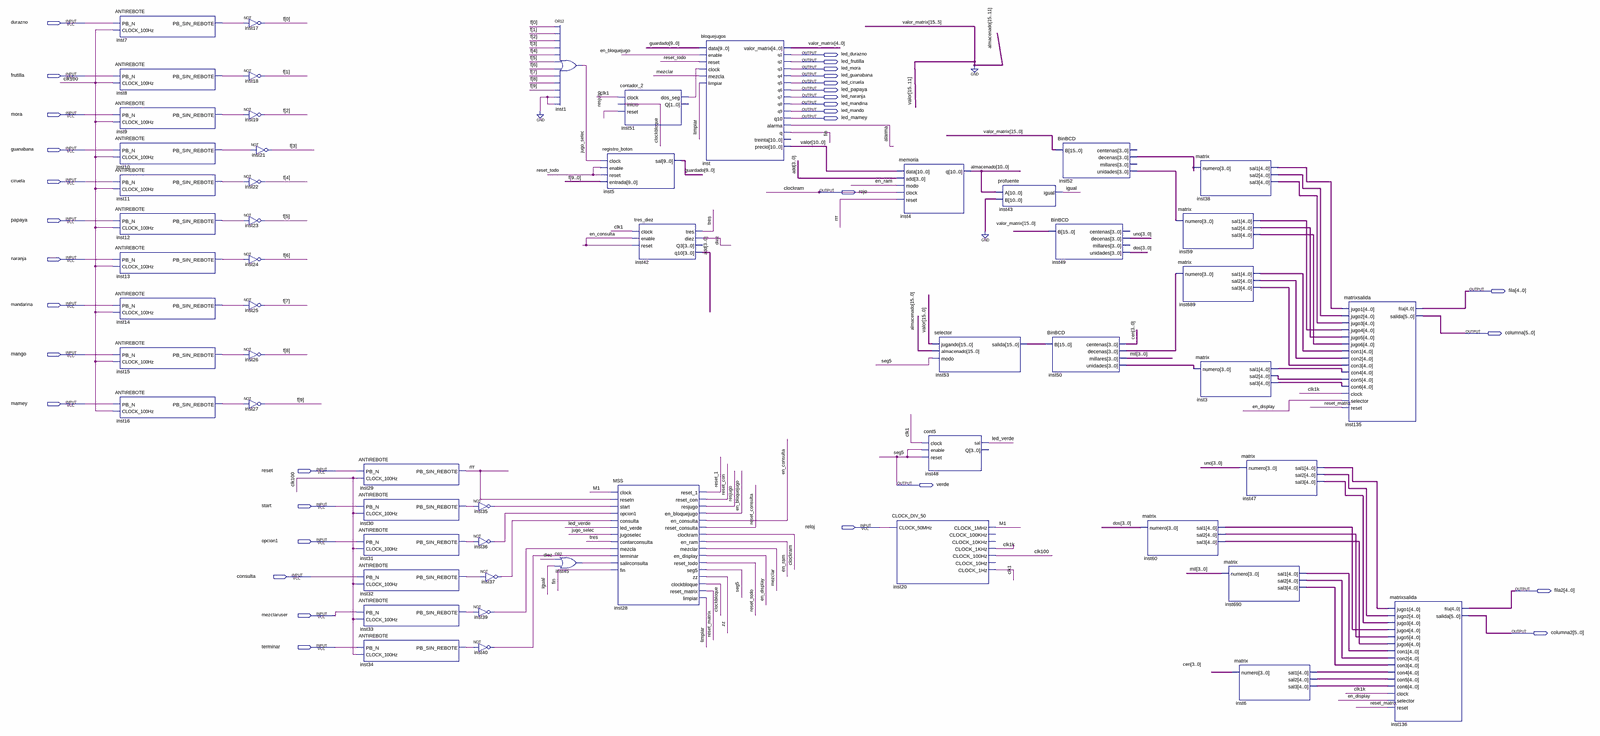
[diagram p0: schematic sheet, whole]
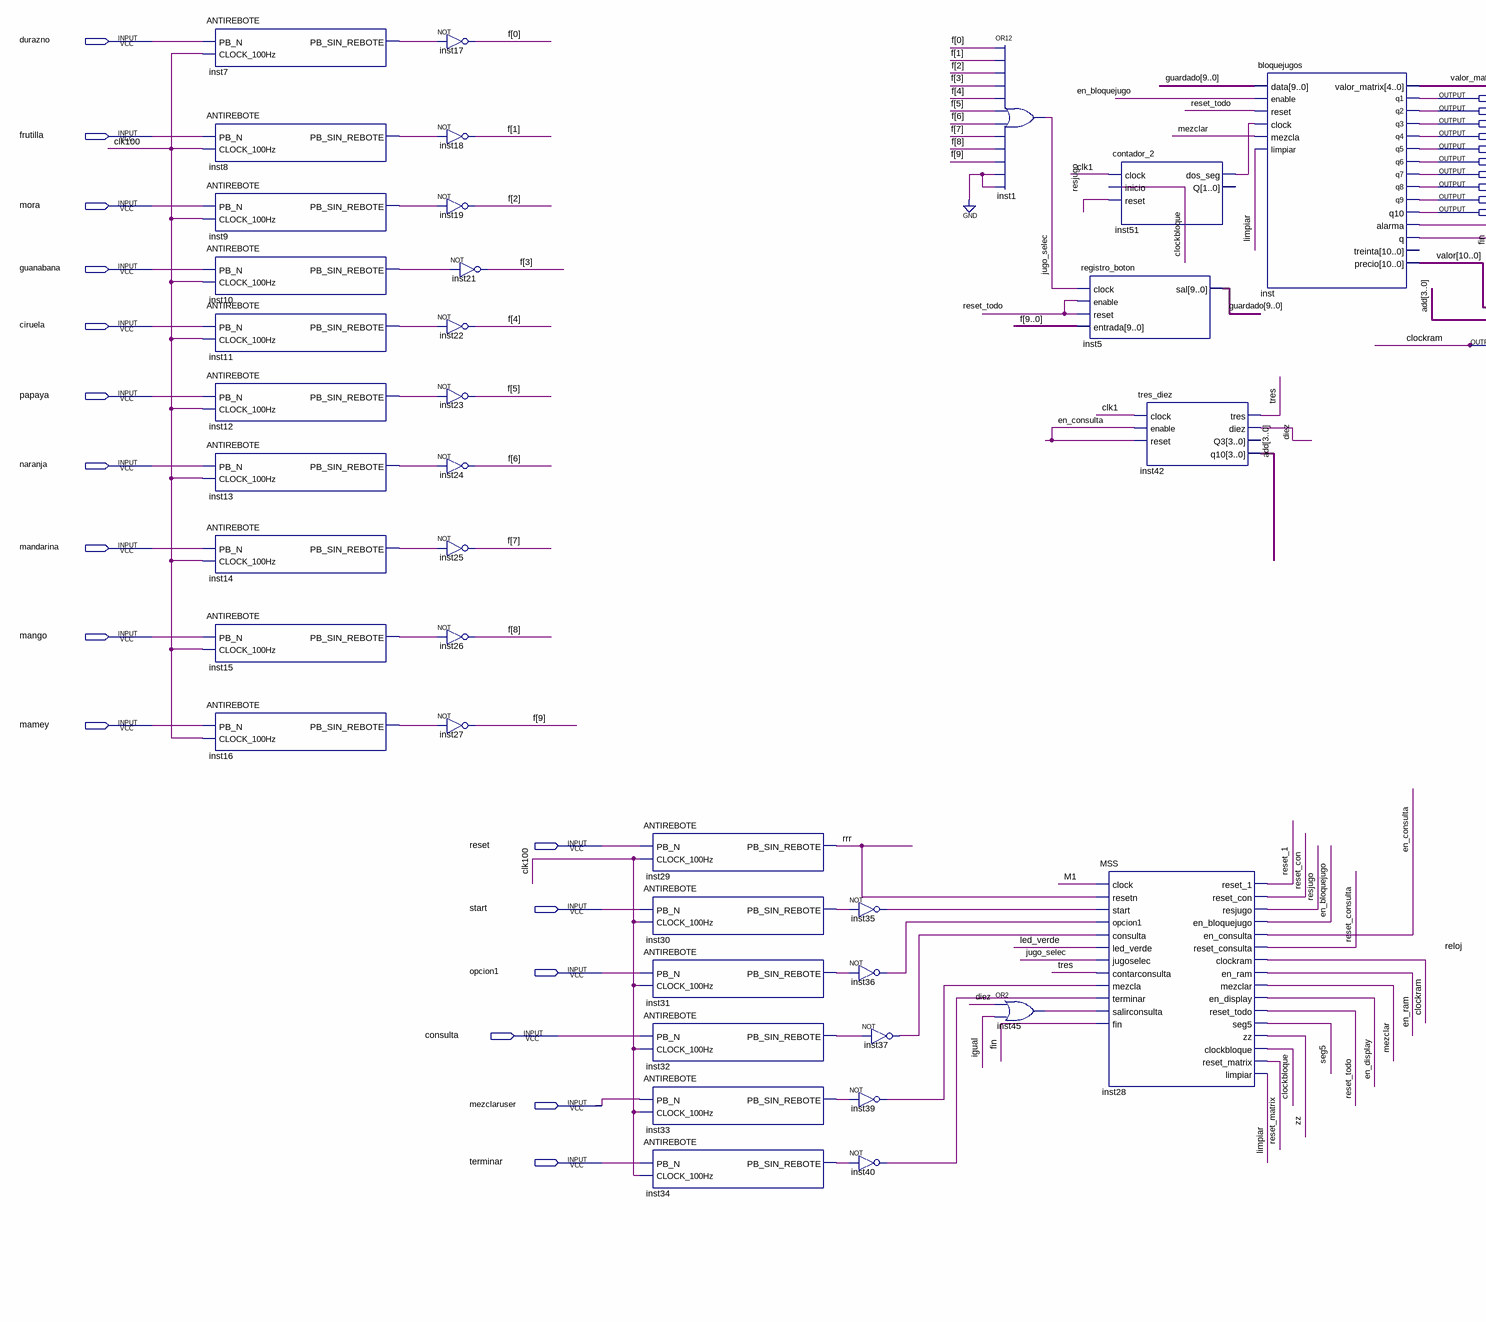
[diagram p1: schematic sheet, left part]
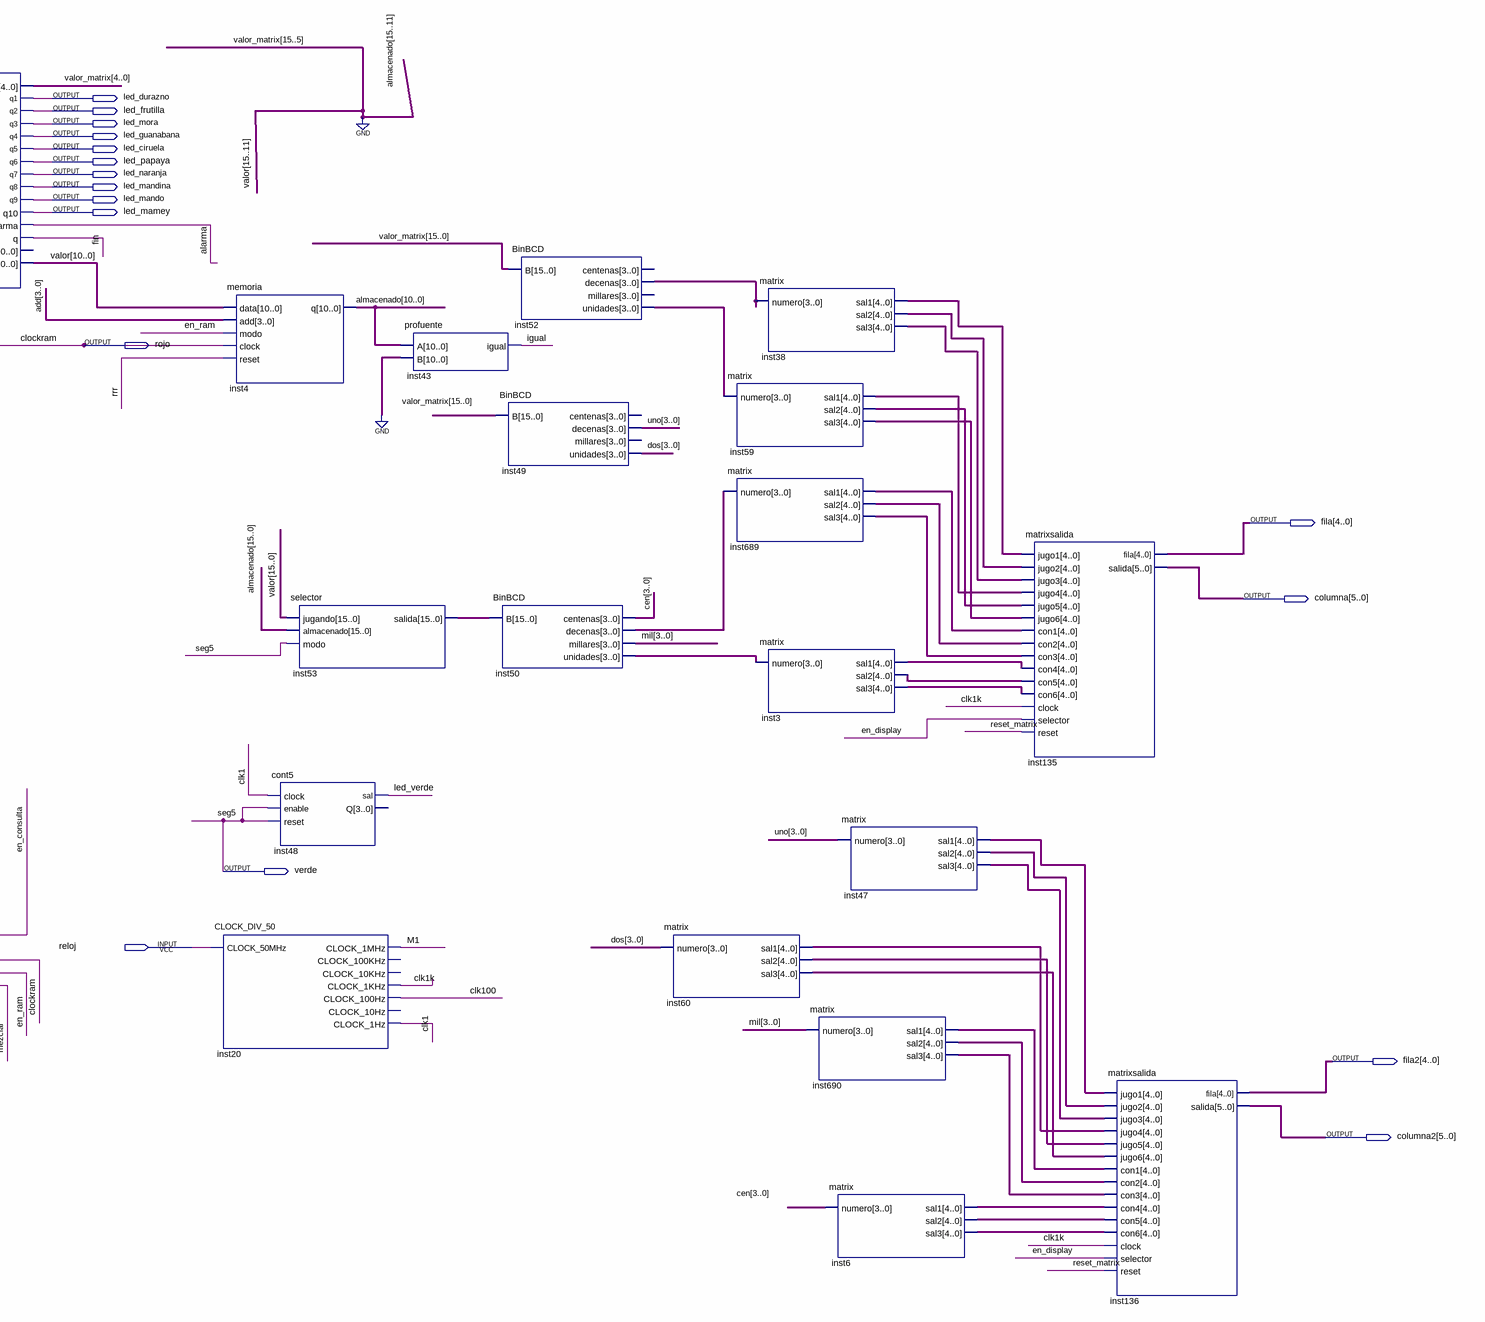
[diagram p2: schematic sheet, right part]
// Quartus schematic jugo.bdf as structural Verilog: 56 symbols, 33 pins
module jugo (
  input  durazno,
  input  frutilla,
  input  mora,
  input  guanabana,
  input  ciruela,
  input  papaya,
  input  naranja,
  input  mandarina,
  input  mango,
  input  mamey,
  input  reset,
  input  start,
  input  reloj,
  input  opcion1,
  input  consulta,
  input  mezclaruser,
  input  terminar,
  output led_durazno,
  output led_frutilla,
  output led_mora,
  output led_guanabana,
  output led_ciruela,
  output led_papaya,
  output led_naranja,
  output led_mandina,
  output led_mando,
  output led_mamey,
  output rojo,
  output [4:0] fila,
  output [5:0] columna,
  output verde,
  output [4:0] fila2,
  output [5:0] columna2
);

  wire alarma, clk1, clk1k, clk100, clockbloque, diez, en_bloquejugo, en_consulta, en_display, en_ram, fin,
       igual, inst7_pb_sin_rebote, inst8_pb_sin_rebote, inst9_pb_sin_rebote, inst10_pb_sin_rebote,
       inst11_pb_sin_rebote, inst12_pb_sin_rebote, inst13_pb_sin_rebote, inst14_pb_sin_rebote,
       inst15_pb_sin_rebote, inst16_pb_sin_rebote, inst30_pb_sin_rebote, inst31_pb_sin_rebote,
       inst32_pb_sin_rebote, inst33_pb_sin_rebote, inst34_pb_sin_rebote, inst35_out, inst36_out, inst37_out,
       inst39_out, inst40_out, inst45_out, inst51_dos_seg, jugo_selec, led_verde, limpiar, M1, mezclar,
       reset_1, reset_con, reset_consulta, reset_matrix, reset_todo, resjugo, rrr, tres, zz;
  wire [3:0] add, cen, dos, inst50_decenas, inst50_unidades, inst52_decenas, inst52_unidades, mil, uno;
  wire [4:0] inst3_sal1, inst3_sal2, inst3_sal3, inst6_sal1, inst6_sal2, inst6_sal3, inst38_sal1,
       inst38_sal2, inst38_sal3, inst47_sal1, inst47_sal2, inst47_sal3, inst59_sal1, inst59_sal2,
       inst59_sal3, inst60_sal1, inst60_sal2, inst60_sal3, inst689_sal1, inst689_sal2, inst689_sal3,
       inst690_sal1, inst690_sal2, inst690_sal3;
  wire [9:0] f, guardado;
  wire [10:0] almacenado;
  wire [15:0] inst53_salida, valor, valor_matrix;

  ANTIREBOTE inst7 (.PB_N(durazno), .CLOCK_100Hz(clk100), .PB_SIN_REBOTE(inst7_pb_sin_rebote));
  ANTIREBOTE inst8 (.PB_N(frutilla), .CLOCK_100Hz(clk100), .PB_SIN_REBOTE(inst8_pb_sin_rebote));
  ANTIREBOTE inst9 (.PB_N(mora), .CLOCK_100Hz(clk100), .PB_SIN_REBOTE(inst9_pb_sin_rebote));
  ANTIREBOTE inst10 (.PB_N(guanabana), .CLOCK_100Hz(clk100), .PB_SIN_REBOTE(inst10_pb_sin_rebote));
  ANTIREBOTE inst11 (.PB_N(ciruela), .CLOCK_100Hz(clk100), .PB_SIN_REBOTE(inst11_pb_sin_rebote));
  ANTIREBOTE inst12 (.PB_N(papaya), .CLOCK_100Hz(clk100), .PB_SIN_REBOTE(inst12_pb_sin_rebote));
  ANTIREBOTE inst13 (.PB_N(naranja), .CLOCK_100Hz(clk100), .PB_SIN_REBOTE(inst13_pb_sin_rebote));
  ANTIREBOTE inst14 (.PB_N(mandarina), .CLOCK_100Hz(clk100), .PB_SIN_REBOTE(inst14_pb_sin_rebote));
  ANTIREBOTE inst15 (.PB_N(mango), .CLOCK_100Hz(clk100), .PB_SIN_REBOTE(inst15_pb_sin_rebote));
  ANTIREBOTE inst16 (.PB_N(mamey), .CLOCK_100Hz(clk100), .PB_SIN_REBOTE(inst16_pb_sin_rebote));
  not inst17 (f[0], inst7_pb_sin_rebote);
  not inst18 (f[1], inst8_pb_sin_rebote);
  not inst19 (f[2], inst9_pb_sin_rebote);
  not inst21 (f[3], inst10_pb_sin_rebote);
  not inst22 (f[4], inst11_pb_sin_rebote);
  not inst23 (f[5], inst12_pb_sin_rebote);
  not inst24 (f[6], inst13_pb_sin_rebote);
  not inst25 (f[7], inst14_pb_sin_rebote);
  not inst26 (f[8], inst15_pb_sin_rebote);
  not inst27 (f[9], inst16_pb_sin_rebote);
  ANTIREBOTE inst29 (.PB_N(reset), .CLOCK_100Hz(clk100), .PB_SIN_REBOTE(rrr));
  ANTIREBOTE inst30 (.PB_N(start), .CLOCK_100Hz(clk100), .PB_SIN_REBOTE(inst30_pb_sin_rebote));
  ANTIREBOTE inst31 (.PB_N(opcion1), .CLOCK_100Hz(clk100), .PB_SIN_REBOTE(inst31_pb_sin_rebote));
  ANTIREBOTE inst32 (.PB_N(consulta), .CLOCK_100Hz(clk100), .PB_SIN_REBOTE(inst32_pb_sin_rebote));
  ANTIREBOTE inst33 (.PB_N(mezclaruser), .CLOCK_100Hz(clk100), .PB_SIN_REBOTE(inst33_pb_sin_rebote));
  ANTIREBOTE inst34 (.PB_N(terminar), .CLOCK_100Hz(clk100), .PB_SIN_REBOTE(inst34_pb_sin_rebote));
  not inst35 (inst35_out, inst30_pb_sin_rebote);
  not inst36 (inst36_out, inst31_pb_sin_rebote);
  not inst37 (inst37_out, inst32_pb_sin_rebote);
  not inst39 (inst39_out, inst33_pb_sin_rebote);
  not inst40 (inst40_out, inst34_pb_sin_rebote);
  or inst1 (jugo_selec, f[0], f[1], f[2], f[3], f[4], f[5], f[6], f[7], f[8], f[9], 1'b0, 1'b0);
  or inst45 (inst45_out, diez, igual);
  registro_boton inst5 (.clock(jugo_selec), .enable(reset_todo), .reset(reset_todo), .entrada(f), .sal(guardado));
  contador_2 inst51 (.clock(clk1), .inicio(clockbloque), .reset(resjugo), .dos_seg(inst51_dos_seg));  // open: Q
  MSS inst28 (
    .clock(M1), .resetn(rrr), .start(inst35_out), .opcion1(inst36_out), .consulta(inst37_out),
    .led_verde(led_verde), .jugoselec(jugo_selec), .contarconsulta(tres), .mezcla(inst39_out),
    .terminar(inst40_out), .salirconsulta(inst45_out), .fin(fin), .reset_1(reset_1), .reset_con(reset_con),
    .resjugo(resjugo), .en_bloquejugo(en_bloquejugo), .en_consulta(en_consulta),
    .reset_consulta(reset_consulta), .clockram(rojo), .en_ram(en_ram), .mezclar(mezclar),
    .en_display(en_display), .reset_todo(reset_todo), .seg5(verde), .zz(zz), .clockbloque(clockbloque),
    .reset_matrix(reset_matrix), .limpiar(limpiar));
  tres_diez inst42 (
    .clock(clk1), .enable(en_consulta), .reset(en_consulta), .tres(tres), .diez(diez), .q10(add));  // open: Q3
  bloquejugos inst (
    .data(guardado), .enable(en_bloquejugo), .reset(reset_todo), .clock(inst51_dos_seg), .mezcla(mezclar),
    .limpiar(limpiar), .valor_matrix(valor_matrix[4:0]), .q1(led_durazno), .q2(led_frutilla), .q3(led_mora),
    .q4(led_guanabana), .q5(led_ciruela), .q6(led_papaya), .q7(led_naranja), .q8(led_mandina),
    .q9(led_mando), .q10(led_mamey), .alarma(alarma), .q(fin), .precio(valor[10:0]));  // open: treinta
  memoria inst4 (.data(valor[10:0]), .add(add), .modo(en_ram), .clock(rojo), .reset(rrr), .q(almacenado));
  CLOCK_DIV_50 inst20 (
    .CLOCK_50MHz(reloj), .CLOCK_1MHz(M1), .CLOCK_1KHz(clk1k), .CLOCK_100Hz(clk100), .CLOCK_1Hz(clk1));  // open: CLOCK_100KHz, CLOCK_10KHz, CLOCK_10Hz
  selector inst53 (.jugando(valor), .almacenado({{5{1'b0}}, almacenado}), .modo(verde), .salida(inst53_salida));
  cont5 inst48 (.clock(clk1), .enable(verde), .reset(verde), .sal(led_verde));  // open: Q
  profuente inst43 (.A(almacenado), .B({11{1'b0}}), .igual(igual));
  BinBCD inst49 (.B(valor_matrix), .decenas(uno), .unidades(dos));  // open: centenas, millares
  BinBCD inst50 (
    .B(inst53_salida), .centenas(cen), .decenas(inst50_decenas), .millares(mil), .unidades(inst50_unidades));
  BinBCD inst52 (.B(valor_matrix), .decenas(inst52_decenas), .unidades(inst52_unidades));  // open: centenas, millares
  matrix inst60 (.numero(dos), .sal1(inst60_sal1), .sal2(inst60_sal2), .sal3(inst60_sal3));
  matrix inst38 (.numero(inst52_decenas), .sal1(inst38_sal1), .sal2(inst38_sal2), .sal3(inst38_sal3));
  matrix inst59 (.numero(inst52_unidades), .sal1(inst59_sal1), .sal2(inst59_sal2), .sal3(inst59_sal3));
  matrix inst689 (.numero(inst50_decenas), .sal1(inst689_sal1), .sal2(inst689_sal2), .sal3(inst689_sal3));
  matrix inst3 (.numero(inst50_unidades), .sal1(inst3_sal1), .sal2(inst3_sal2), .sal3(inst3_sal3));
  matrix inst690 (.numero(mil), .sal1(inst690_sal1), .sal2(inst690_sal2), .sal3(inst690_sal3));
  matrix inst47 (.numero(uno), .sal1(inst47_sal1), .sal2(inst47_sal2), .sal3(inst47_sal3));
  matrix inst6 (.numero(cen), .sal1(inst6_sal1), .sal2(inst6_sal2), .sal3(inst6_sal3));
  matrixsalida inst135 (
    .jugo1(inst38_sal1), .jugo2(inst38_sal2), .jugo3(inst38_sal3), .jugo4(inst59_sal1), .jugo5(inst59_sal2),
    .jugo6(inst59_sal3), .con1(inst689_sal1), .con2(inst689_sal2), .con3(inst689_sal3), .con4(inst3_sal1),
    .con5(inst3_sal2), .con6(inst3_sal3), .clock(clk1k), .selector(en_display), .reset(reset_matrix),
    .fila(fila), .salida(columna));
  matrixsalida inst136 (
    .jugo1(inst47_sal1), .jugo2(inst47_sal2), .jugo3(inst47_sal3), .jugo4(inst60_sal1), .jugo5(inst60_sal2),
    .jugo6(inst60_sal3), .con1(inst690_sal1), .con2(inst690_sal2), .con3(inst690_sal3), .con4(inst6_sal1),
    .con5(inst6_sal2), .con6(inst6_sal3), .clock(clk1k), .selector(en_display), .reset(reset_matrix),
    .fila(fila2), .salida(columna2));

  // Other names for the same wires on the sheet: clockram = rojo; seg5 = verde
endmodule
